# EAGLE schematic I2C_header (EAGLE 9.6.2)
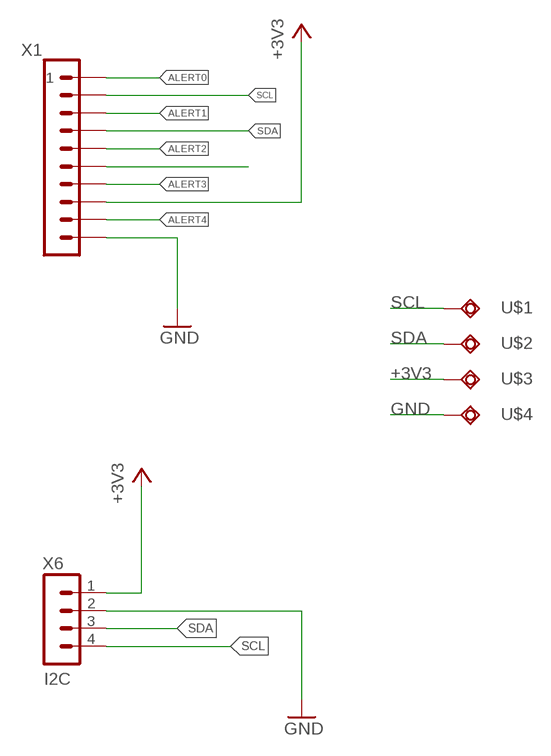
[diagram p0: schematic, sheet 1]

## Parts
U$1  PAD3.0X5.0  [PAD3X5]
U$2  PAD3.0X5.0  [PAD3X5]
U$3  PAD3.0X5.0  [PAD3X5]
U$4  PAD3.0X5.0  [PAD3X5]
X1  FFC_10PLARGE  [FFC_1.0X10_LARGE_PADS]
X6  I2C  JST04_PH  [JST-PH_4]

## Nets
+3V3: U$3.P$1 X1.P$8 X6.1
ALERT0: X1.P$1
ALERT1: X1.P$3
ALERT2: X1.P$5
ALERT3: X1.P$7
ALERT4: X1.P$9
GND: U$4.P$1 X1.P$10 X6.2
N$6: X1.P$6
SCL: U$1.P$1 X1.P$2 X6.4
SDA: U$2.P$1 X1.P$4 X6.3
Unconnected: X1.P$11(SHLD)

## Library data of the parts
U$1-U$4 = SIG_Parts:PAD3.0X5.0
X1 = SIG_Parts:FFC_10P
X6 = RAK3172_board:JST04_*